# EAGLE design port_expander_1_0 (EAGLE 6.6.0)
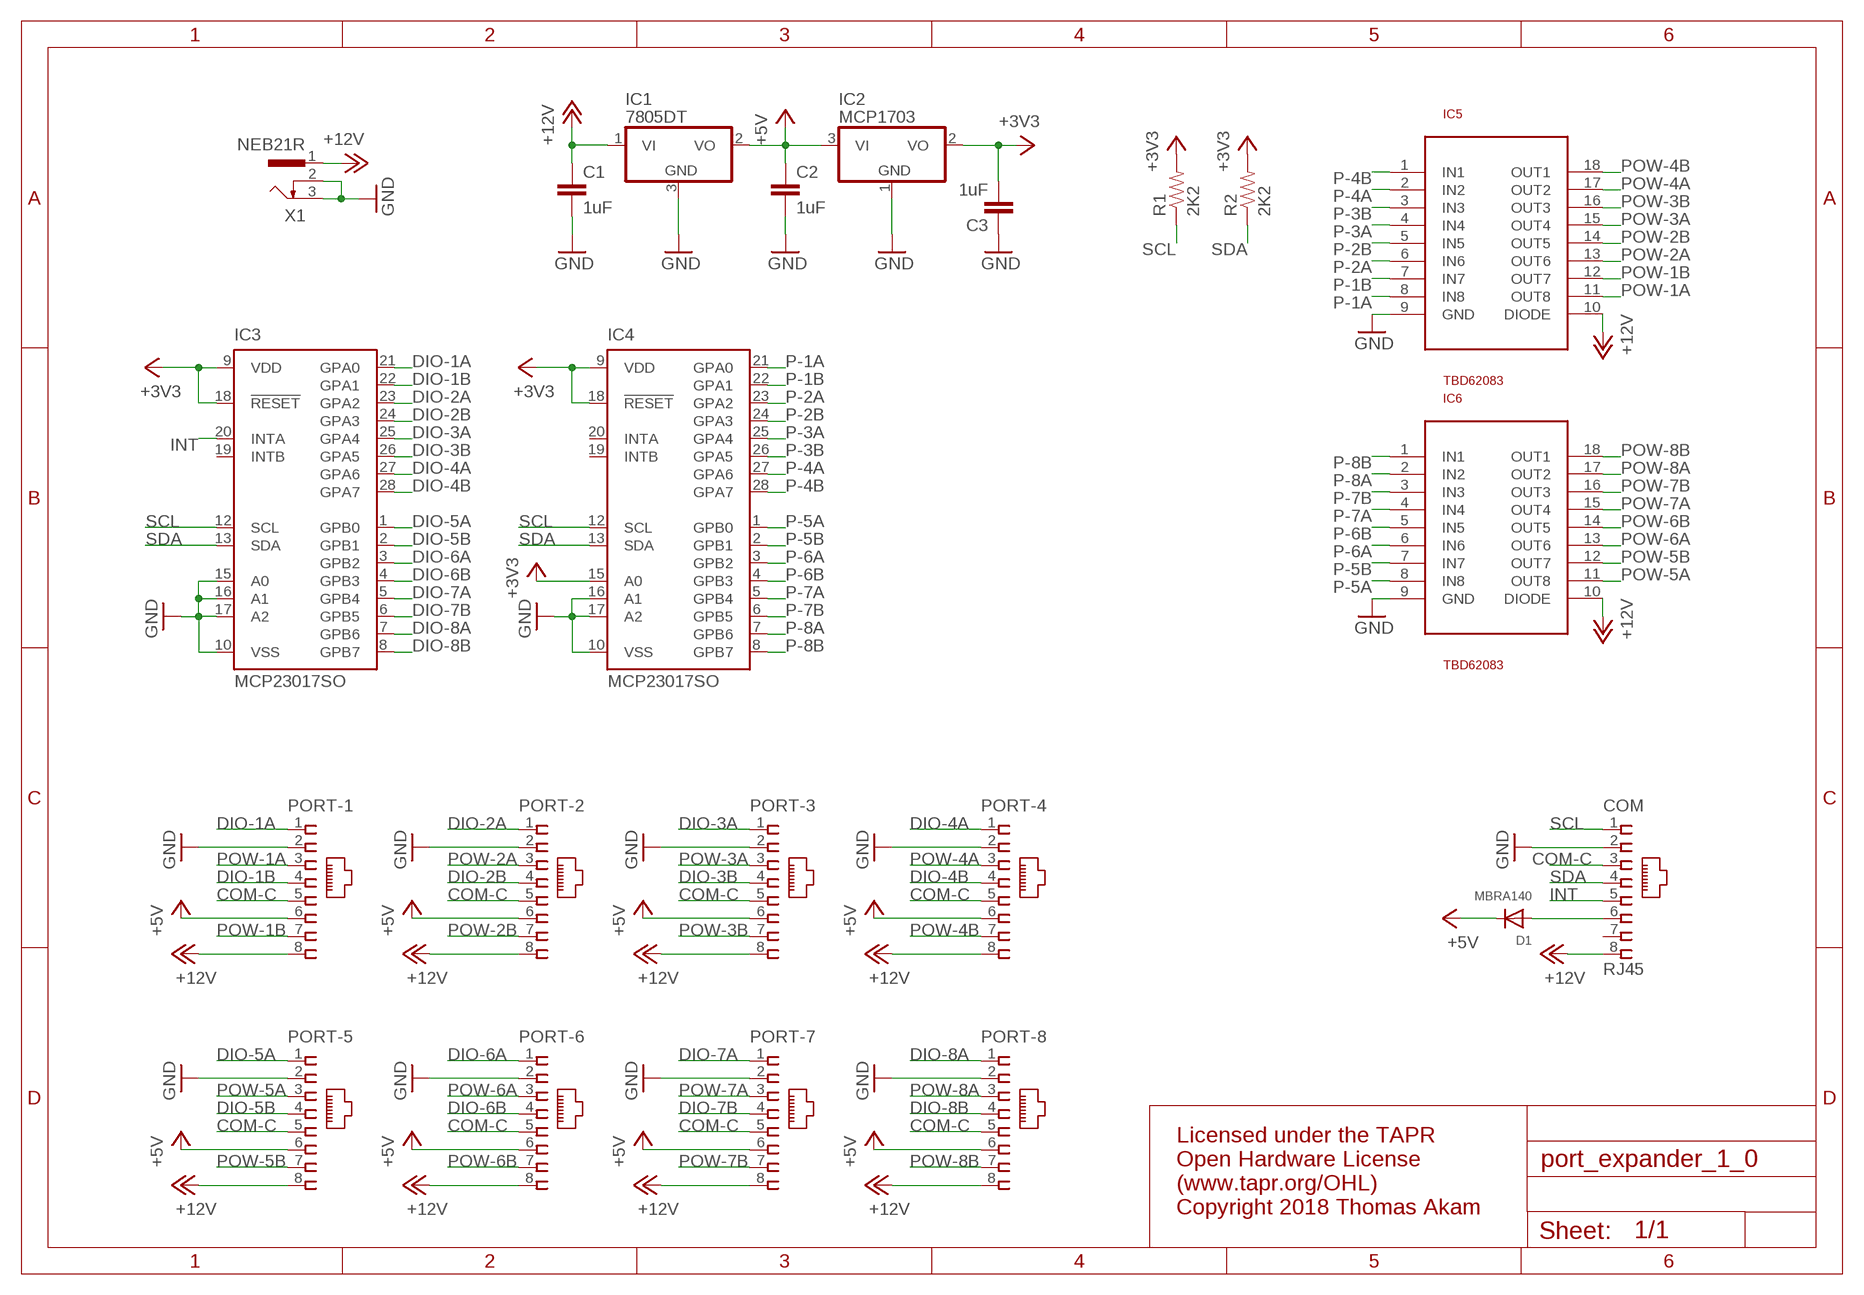
[diagram p0: schematic, sheet 1]

## Parts
C1  1uF  C-EUC0805  [C0805]
C2  1uF  C-EUC0805  [C0805]
C3  1uF  C-EUC0805  [C0805]
COM  RJ45  RJ45VERTICAL  [RJ45-NO-SHIELD-VERTICAL]
D1  MBRA140  DIODESOD-123  [SOD-123]
IC1  7805DT  [TO252]
IC2  MCP1703  MCP1703CB  [SOT23]
IC3  MCP23017SO  [SO28W]
IC4  MCP23017SO  [SO28W]
IC5  TBD62083  ULN2803  [SO18L]
IC6  TBD62083  ULN2803  [SO18L]
PORT-1  RJ45VERTICAL  [RJ45-NO-SHIELD-VERTICAL]
PORT-2  RJ45VERTICAL  [RJ45-NO-SHIELD-VERTICAL]
PORT-3  RJ45VERTICAL  [RJ45-NO-SHIELD-VERTICAL]
PORT-4  RJ45VERTICAL  [RJ45-NO-SHIELD-VERTICAL]
PORT-5  RJ45VERTICAL  [RJ45-NO-SHIELD-VERTICAL]
PORT-6  RJ45VERTICAL  [RJ45-NO-SHIELD-VERTICAL]
PORT-7  RJ45VERTICAL  [RJ45-NO-SHIELD-VERTICAL]
PORT-8  RJ45VERTICAL  [RJ45-NO-SHIELD-VERTICAL]
R1  2K2  0.3OHM-1/8W-1%(0805)  [0805]
R2  2K2  0.3OHM-1/8W-1%(0805)  [0805]
X1  NEB21R  [NEB21R]

## Nets
+3V3: C3.2 IC2.2(VO) IC3.9(VDD) IC3.18(!RESET) IC4.9(VDD) IC4.15(A0) IC4.18(!RESET) R1.2 R2.2
+5V: C2.1 D1.C IC1.2(VO) IC2.3(VI) PORT-1.6 PORT-2.6 PORT-3.6 PORT-4.6 PORT-5.6 PORT-6.6 PORT-7.6 PORT-8.6
+12V: C1.1 COM.8 IC1.1(VI) IC5.10(DIODE) IC6.10(DIODE) PORT-1.8 PORT-2.8 PORT-3.8 PORT-4.8 PORT-5.8 PORT-6.8 PORT-7.8 PORT-8.8 X1.1
COM-C: COM.3 PORT-1.5 PORT-2.5 PORT-3.5 PORT-4.5 PORT-5.5 PORT-6.5 PORT-7.5 PORT-8.5
DIO-1A: IC3.21(GPA0) PORT-1.1
DIO-1B: IC3.22(GPA1) PORT-1.4
DIO-2A: IC3.23(GPA2) PORT-2.1
DIO-2B: IC3.24(GPA3) PORT-2.4
DIO-3A: IC3.25(GPA4) PORT-3.1
DIO-3B: IC3.26(GPA5) PORT-3.4
DIO-4A: IC3.27(GPA6) PORT-4.1
DIO-4B: IC3.28(GPA7) PORT-4.4
DIO-5A: IC3.1(GPB0) PORT-5.1
DIO-5B: IC3.2(GPB1) PORT-5.4
DIO-6A: IC3.3(GPB2) PORT-6.1
DIO-6B: IC3.4(GPB3) PORT-6.4
DIO-7A: IC3.5(GPB4) PORT-7.1
DIO-7B: IC3.6(GPB5) PORT-7.4
DIO-8A: IC3.7(GPB6) PORT-8.1
DIO-8B: IC3.8(GPB7) PORT-8.4
GND: C1.2 C2.2 C3.1 COM.2 IC1.3(GND) IC2.1(GND) IC3.10(VSS) IC3.15(A0) IC3.16(A1) IC3.17(A2) IC4.10(VSS) IC4.16(A1) IC4.17(A2) IC5.9(GND) IC6.9(GND) PORT-1.2 PORT-2.2 PORT-3.2 PORT-4.2 PORT-5.2 PORT-6.2 PORT-7.2 PORT-8.2 X1.2 X1.3
INT: COM.5 IC3.20(INTA)
N$5: COM.6 D1.A
P-1A: IC4.21(GPA0) IC5.8(IN8)
P-1B: IC4.22(GPA1) IC5.7(IN7)
P-2A: IC4.23(GPA2) IC5.6(IN6)
P-2B: IC4.24(GPA3) IC5.5(IN5)
P-3A: IC4.25(GPA4) IC5.4(IN4)
P-3B: IC4.26(GPA5) IC5.3(IN3)
P-4A: IC4.27(GPA6) IC5.2(IN2)
P-4B: IC4.28(GPA7) IC5.1(IN1)
P-5A: IC4.1(GPB0) IC6.8(IN8)
P-5B: IC4.2(GPB1) IC6.7(IN7)
P-6A: IC4.3(GPB2) IC6.6(IN6)
P-6B: IC4.4(GPB3) IC6.5(IN5)
P-7A: IC4.5(GPB4) IC6.4(IN4)
P-7B: IC4.6(GPB5) IC6.3(IN3)
P-8A: IC4.7(GPB6) IC6.2(IN2)
P-8B: IC4.8(GPB7) IC6.1(IN1)
POW-1A: IC5.11(OUT8) PORT-1.3
POW-1B: IC5.12(OUT7) PORT-1.7
POW-2A: IC5.13(OUT6) PORT-2.3
POW-2B: IC5.14(OUT5) PORT-2.7
POW-3A: IC5.15(OUT4) PORT-3.3
POW-3B: IC5.16(OUT3) PORT-3.7
POW-4A: IC5.17(OUT2) PORT-4.3
POW-4B: IC5.18(OUT1) PORT-4.7
POW-5A: IC6.11(OUT8) PORT-5.3
POW-5B: IC6.12(OUT7) PORT-5.7
POW-6A: IC6.13(OUT6) PORT-6.3
POW-6B: IC6.14(OUT5) PORT-6.7
POW-7A: IC6.15(OUT4) PORT-7.3
POW-7B: IC6.16(OUT3) PORT-7.7
POW-8A: IC6.17(OUT2) PORT-8.3
POW-8B: IC6.18(OUT1) PORT-8.7
SCL: COM.1 IC3.12(SCL) IC4.12(SCL) R1.1
SDA: COM.4 IC3.13(SDA) IC4.13(SDA) R2.1
Unconnected: COM.7 IC3.19(INTB) IC4.19(INTB) IC4.20(INTA)

## Notes on the sheet
- Licensed under the TAPR
  Open Hardware License
  (www.tapr.org/OHL)
  Copyright 2018 Thomas Akam

## Library data of the parts
C1 C2 = resistor:C-EU: CAPACITOR, European symbol
C3 = rcl:C-EU: CAPACITOR, European symbol
COM PORT-1-PORT-8 = con-tycoelectronics-vertical_RJ45:RJ45: CORCOM Modular RJ Jacks No Shield Source: www.tycoelectronics.com .. ENG_DS_1654001_1099_RJ_L_0507.pdf
D1 = adafruit:DIODE: Diode SMADIODE - SMA Surface Mount Package 20V 1A Schottky Diode Digikey: 641-1014-6-ND DO-1N4148 - Through Hole Small Current Diode SOD-123 20V 1 A (.5mV Vf) Schottky Diode - Digikey: MBRX120TPMSCT-ND SOD-323 10V 570mA (.38mV Vf, 3ns) Schottky Diode - Digikey: ZLLS410CT-ND SOD-523 30V 30mA Schottky Diode (RB751S-40TE61) - Digikey: RB751S-40TE61CT-ND SOT23-R/W - SOT23 Package (R = Solder Paste/Reflow Ovens, W = Hand-Soldering) BAT54Film 40V 300mA - Digikey: 497-7162-1-ND
IC1 = linear:78*: Positive VOLTAGE REGULATOR Source: http://cache.national.com/ds/LM/LM78L05.pdf http://www.fairchildsemi.com/ds/LM/LM7805.pdf
IC2 = linear:MCP1703: 250 mA, 16V, Low Quiescent Current LDO Regulator Source: http://ww1.microchip.com/downloads/en/DeviceDoc/22049b.pdf
IC3 IC4 = microchip:MCP23017: http://ww1.microchip.com/downloads/en/DeviceDoc/21952a.pdf Source: http://ww1.microchip.com/downloads/en/DeviceDoc/21952a.pdf; MF: MICROCHIP; MPN: MCP23017-E/SO; OC_FARNELL: 1332087; OC_NEWARK: 31K2958
IC5 IC6 = uln2803:ULN2803
R1 R2 = SparkFun-Resistors:0.3OHM-1/8W-1%(0805): RES-11622; PROD_ID: RES-11622; VALUE: 0.3
X1 = con-lumberg:NEB21R: Netzgeräte-Einbaukupplung abgewinkelte Ausführung mit Öffner Source: http://www.lumberg.com/Produkte/PDFs/NEB21R.pdf; MPN: NEB 21 R; OC_FARNELL: 1217037; OC_NEWARK: 97K6458

## Board
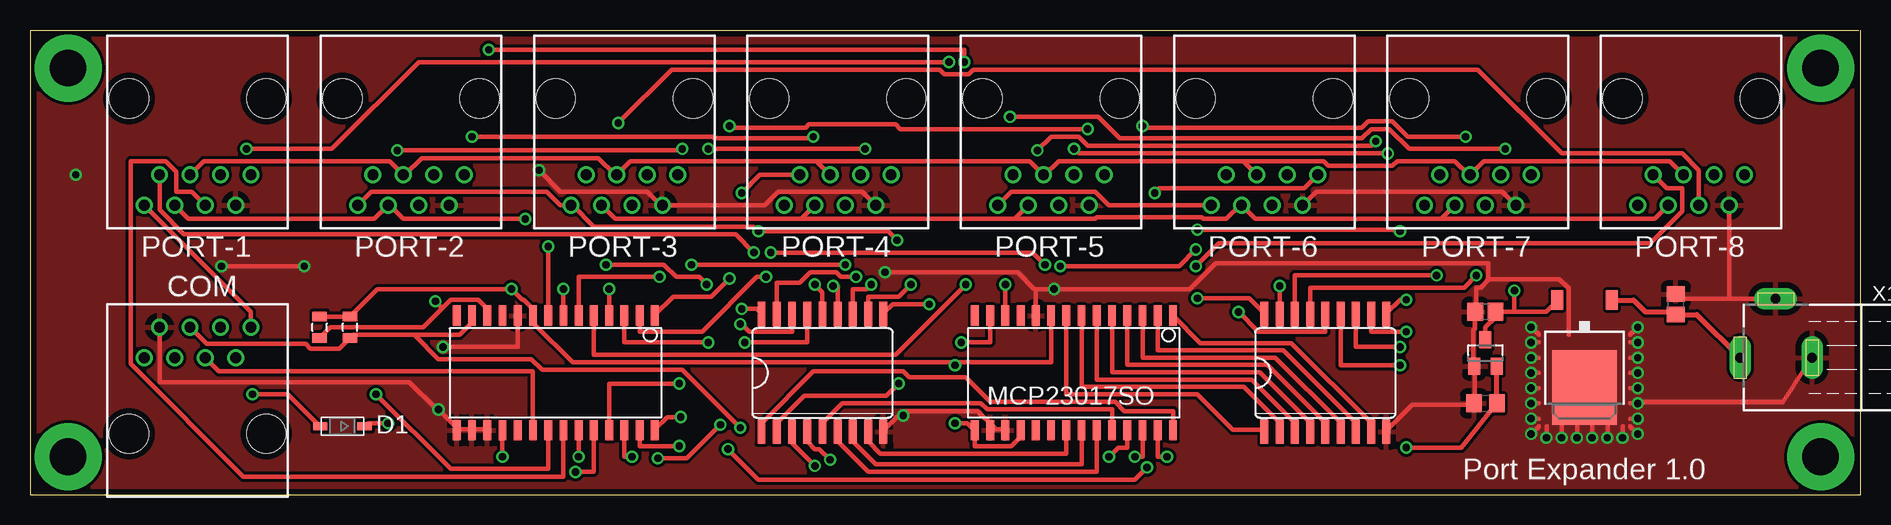
[diagram p1: board, top side]
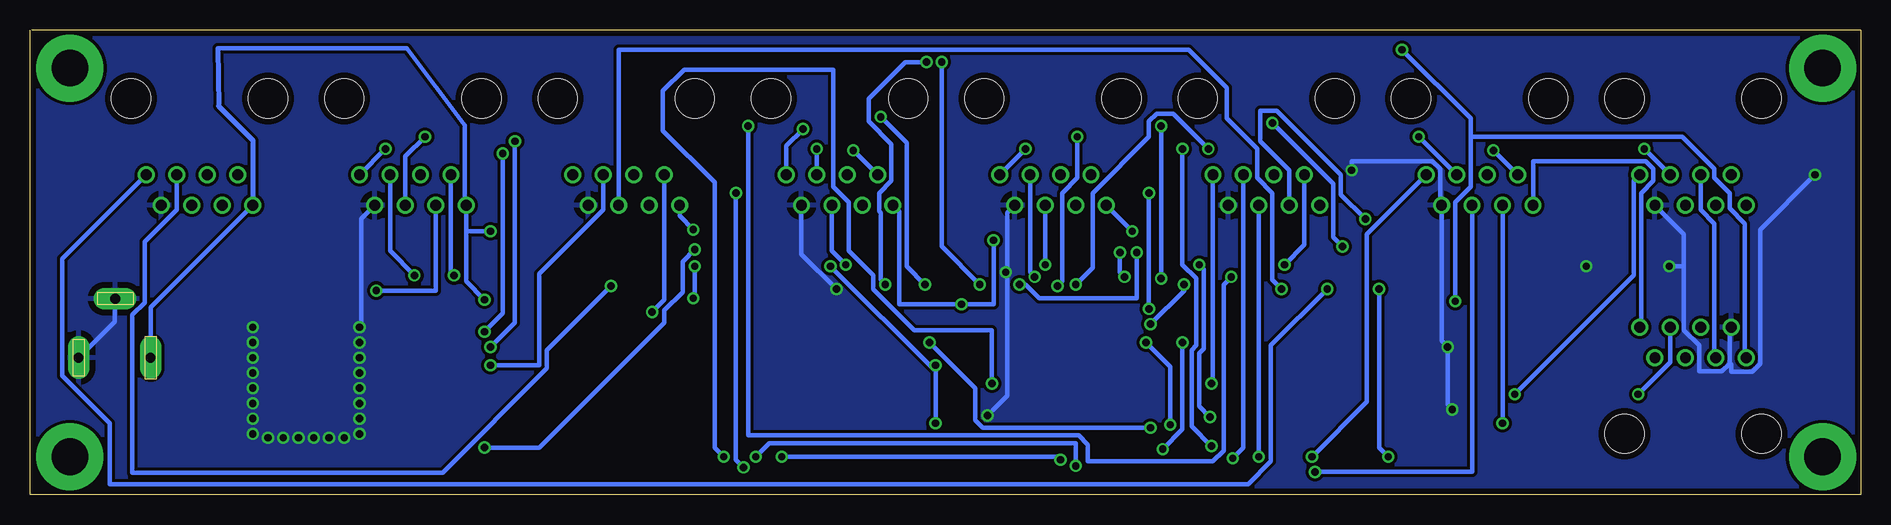
[diagram p2: board, bottom side, seen from below]

Size 152.56 x 38.73 mm. Coordinates in mm from the lower left corner, seen from the top.
Outline: 152.56,38.7 152.56,0 0,0 0,38.7
Outline: 0,38.73 152.4,38.73
Copper layers (1*16): Top 0.035mm / dielectric 1.5mm / Bottom 0.035mm
Design rules "default *": minimum track width 14mil, minimum drill 24mil, track to track 10mil, track to pad 10mil, pad to pad 10mil, via to via 10mil, smd to smd 10mil, copper to edge 20mil, drill to drill 8mil, minimum pad ring 10mil, minimum via ring 8mil, stop-mask expansion 4mil, vias tented up to drill 0mil, thermal gap 20mil
vRestrict: area 34.9,6.3 to 52.8,14; area 60.1,6.5 to 71.9,14.1; area 22.9,8.3 to 27.9,15.9; area 8.9,19.7 to 18.4,21.6; area 44.5,19.7 to 54,21.6; area 10.8,16.5 to 17.1,18.4; area 78.1,6.3 to 95.9,14; area 102.2,6.3 to 113.7,14; area 97.8,19.7 to 107.3,22.2; area 115.6,19.7 to 125.1,22.2; area 133.4,19.7 to 142.9,22.2; area 62.2,19.7 to 71.8,22.2; 5 more areas

### Footprints (pad centres in the part's own frame; a part is rotated, then mirrored left to right if it is on the bottom)
C0805 = smd 1.3 x 1.5: 1 -0.85,0; 2 0.85,0
C0805' = smd 1.3 x 1.5: 1 -0.95,0; 2 0.95,0
RJ45-NO-SHIELD-VERTICAL = drill 0.9 pad 1.4: 1 -4.445,5.08; 2 -3.175,7.62; 3 -1.905,5.08; 4 -0.635,7.62; 5 0.635,5.08; 6 1.905,7.62; 7 3.175,5.08; 8 4.445,7.62 | hole 3.251: -5.715,-1.27; 5.715,-1.27
SOD-123 = smd 1.2 x 0.7: A 1.85,0; C -1.85,0
TO252 = smd 1 x 1.6: 1 -2.28,-4.8; 2 2.28,-4.8 | smd 5.4 x 6.2: 3 0,2.5
SOT23 = smd 1 x 1.4: 1 -0.95,-1.1; 2 0.95,-1.1; 3 0,1.1
SO28W = smd 0.65 x 1.7: 1 -7.62,-4.78; 2 -6.35,-4.78; 3 -5.08,-4.78; 4 -3.81,-4.78; 5 -2.54,-4.78; 6 -1.27,-4.78; 7 0,-4.78; 8 1.27,-4.78; 9 2.54,-4.78; 10 3.81,-4.78; 11 5.08,-4.78; 12 6.35,-4.78; 13 7.62,-4.78; 14 8.89,-4.78; 15 8.89,4.78; 16 7.62,4.78; 17 6.35,4.78; 18 5.08,4.78; 19 3.81,4.78; 20 2.54,4.78; 21 1.27,4.78; 22 0,4.78; 23 -1.27,4.78; 24 -2.54,4.78; 25 -3.81,4.78; 26 -5.08,4.78; 27 -6.35,4.78; 28 -7.62,4.78
SO18L = smd 0.66 x 2.032: 1 -5.08,-4.902; 2 -3.81,-4.902; 3 -2.54,-4.902; 4 -1.27,-4.902; 5 0,-4.902; 6 1.27,-4.902; 7 2.54,-4.902; 8 3.81,-4.902; 9 5.08,-4.902; 10 5.08,4.902; 11 3.81,4.902; 12 2.54,4.902; 13 1.27,4.902; 14 0,4.902; 15 -1.27,4.902; 16 -2.54,4.902; 17 -3.81,4.902; 18 -5.08,4.902
0805 = smd 0.8 x 1.2: 1 -0.9,0; 2 0.9,0
NEB21R = drill 0.813 pad 1.778 long: 1 0,7.35; 2 4.9,4.4; 3 0,1.35

### Placement (x,y rotation side)
C1  137.16,15.88 90 top
C2  121.28,15.24 180 top
C3  1uF  [C0805']  121.28,7.62 0 top
COM  13.97,6.35 0 top
D1  26.04,5.71 180 top
IC1  129.54,11.43 180 top
IC2  121.28,11.81 0 top
IC3  44.45,10.16 180 top
IC4  87.63,10.16 180 top
IC5  66.04,10.16 0 top
IC6  107.95,10.16 0 top
PORT-1  13.97,31.75 180 top
PORT-2  31.75,31.75 180 top
PORT-3  49.53,31.75 180 top
PORT-4  67.31,31.75 180 top
PORT-5  85.09,31.75 180 top
PORT-6  102.87,31.75 180 top
PORT-7  120.65,31.75 180 top
PORT-8  138.43,31.75 180 top
R1  24.13,13.97 90 top
R2  26.67,13.97 90 top
X1  149.86,11.43 90 top

### Tracks (layer width: path | path; a pad name or v marks a point on that pad's centre or on a via)
+3V3  (via drill 0.61)
  Top 0.356: 122.3,10.79 IC2.2 | IC4.18 82.55,4.83 81.79,4.06 78.74,4.06 IC4.15 78.61,5.46 78.11,5.97 v77.09,5.97 | R1.2 R2.2 26.8,14.99 28.96,17.14 v40.13,17.14 41.02,16.26 41.15,16.26 41.91,15.49 IC3.9 42.04,14.86 42.04,14.22 45.21,11.05 77.09,11.05 | v39.37,3.17 IC3.18 | IC4.9 85.09,11.05 77.09,11.05 | v77.09,10.79 77.09,11.05 | v114.68,3.94 119.25,3.94 | v97.16,20.45 95.76,19.05 v85.85,19.05
  Top 0.406: IC2.2 C3.2 119.25,3.94
  Bottom 0.356: v39.37,3.17 40.13,3.94 v40.13,17.14 | v77.09,5.97 v77.09,10.79 77.22,10.41 v85.85,19.05 | v114.68,3.94 110.11,3.94 99.69,14.35 99.69,15.37 98.17,16.89 98.17,19.43 v97.16,20.45
+5V  (via drill 0.61)
  Top 0.356: IC2.3 121.28,13.97 122.05,14.73 122.05,15.24 C2.1 123.7,15.24 | 123.7,15.24 126.36,15.24 127.25,16.13 IC1.2 | 117.6,22.99 102.11,22.99 PORT-6.6 100.84,24.13 99.69,22.99 97.79,22.99 97.66,23.11 88.9,23.11 88.77,22.99 82.17,22.99 82.11,23.05 | PORT-7.6 117.6,22.99 | PORT-8.6 135.38,22.99 117.6,22.99 | v123.7,17.02 123.7,15.24 | v29.84,5.97 28.19,5.97 27.94,5.71 D1.C | PORT-1.6 13.21,22.99 28.7,22.99 PORT-2.6 29.97,24.13 31.11,22.99 v41.27,22.99 | PORT-3.6 48.77,22.99 64.26,22.99 | PORT-4.6 64.26,22.99 | 82.11,23.05 82.04,22.99 64.26,22.99 | 82.11,23.05 PORT-5.6
  Bottom 0.356: v123.7,17.02 118.75,17.02 PORT-7.6 | PORT-2.6 v29.84,5.97 | v41.27,22.99 43.31,25.02 43.31,26.67 48.64,32 50.04,32 50.04,29.46 47.62,27.05 PORT-3.6
+12V  (via drill 0.61)
  Top 0.356: 131.62,16.31 IC1.1 | v114.68,16.26 114.17,16.26 113.03,15.11 IC6.10 | v74.93,15.88 71.88,15.88 71.12,15.11 IC5.10 | PORT-6.8 89.92,24.13 88.77,25.27 81.79,25.27 PORT-5.8 | PORT-1.8 18.41,15.24 COM.8 | PORT-2.8 28.45,25.27 43.05,25.27 44.2,24.13 PORT-3.8 45.21,24.13 46.99,22.35 60.33,22.35 v60.71,21.97 71.5,21.97 v72.26,21.21 | v114.17,21.97 114.05,22.1 v97.28,22.1
  Top 0.406: IC1.1 133.63,16.23 134.62,15.24 136.94,15.24 C1.1 138.91,15.03 X1.1
  Bottom 0.356: X1.1 142.49,11.43 142.49,15.65 142.37,15.75 PORT-8.8 | v114.68,16.26 116.2,17.78 116.2,21.97 | 116.2,21.97 PORT-7.8 116.2,24.26 116.33,24.38 116.33,30.8 121.16,37.21 136.91,37.21 | PORT-5.8 80.14,23.62 80.14,15.88 v74.93,15.88 72.26,15.88 v72.26,21.21 | v60.71,21.97 PORT-4.8 | COM.8 18.29,14.1 18.29,25.15 17.27,26.16 17.27,27.18 17.91,27.81 27.3,27.81 PORT-2.8 | v114.17,21.97 116.2,21.97 | v97.28,22.1 98.42,23.24 PORT-6.8
  Bottom 0.406: 136.91,37.21 136.84,32.38 133.99,29.53 PORT-8.8
COM-C
  Top 0.356: PORT-1.5 14.48,27.81 29.97,27.81 PORT-2.5 31.24,26.67 32.64,28.07 47.37,28.07 48.77,26.67 PORT-3.5 50.04,27.81 65.53,27.81 | PORT-8.5 136.65,27.81 121.16,27.81 PORT-7.5 119.89,26.67 118.75,27.81 113.92,27.81 113.54,27.43 108.2,27.43 107.82,27.81 101.22,27.81 101.16,27.75 | PORT-4.5 65.53,27.81 | 65.53,27.81 83.31,27.81 PORT-5.5 84.58,26.67 85.72,27.81 101.09,27.81 101.16,27.75 | 101.16,27.75 PORT-6.5
  Bottom 0.356: COM.3 12.19,11.56 12.19,22.61 13.34,23.75 PORT-1.5
DIO-1A  (via drill 0.61)
  Top 0.356: IC3.21 43.18,2.16 35.05,2.16 v28.83,8.38
  Bottom 0.356: v28.83,8.38 18.92,18.29 18.92,26.16 PORT-1.1
DIO-1B
  Top 0.356: IC3.22 44.45,1.52 17.78,1.52 8.38,10.92 8.38,27.81 11.3,27.81 12.19,26.92 12.19,25.27 13.46,25.27 PORT-1.4
DIO-2A  (via drill 0.61)
  Top 0.356: v45.72,3.17 IC3.23
  Bottom 0.356: v45.72,3.17 41.15,7.75 41.15,21.72 PORT-2.1
DIO-2B  (via drill 0.61)
  Top 0.356: IC3.24 46.99,1.91 v45.47,1.91
  Bottom 0.356: v45.47,1.91 32.38,1.91 PORT-2.4
DIO-3A  (via drill 0.61)
  Top 0.356: IC3.25 48.26,9.27 v54.1,9.27
  Bottom 0.356: v54.1,9.27 53.98,9.4 PORT-3.1
DIO-3B  (via drill 0.61)
  Top 0.356: IC3.26 49.53,3.17 v50.16,3.17
  Bottom 0.356: PORT-3.4 v50.16,3.17
DIO-4A  (via drill 0.61)
  Top 0.356: IC3.27 50.8,4.06 v54.1,4.06 | v69.6,28.83 v56.52,28.83
  Bottom 0.356: v54.1,4.06 55.75,5.71 55.75,12.06 55.37,12.45 55.37,18.03 56.52,19.18 v56.52,28.83 | PORT-4.1 v69.6,28.83
DIO-4B  (via drill 0.61)
  Top 0.356: v54.23,6.48 53.09,6.48 52.07,5.46 IC3.28 | v67.94,19.18 v55.12,19.18
  Bottom 0.356: v54.23,6.48 55.12,7.37 55.12,11.81 54.74,12.19 54.74,18.8 v55.12,19.18 | PORT-4.4 v67.94,19.18
DIO-5A  (via drill 0.61)
  Top 0.356: v58.29,18.03 56.77,16.51 53.59,16.51 52.07,14.99 IC3.1 | v58.29,30.73 58.42,30.61 64.64,30.61 64.9,30.86 72.14,30.86 72.52,30.48 v88.14,30.48
  Bottom 0.356: v58.29,30.73 v58.29,18.03 | v88.14,30.48 89.53,29.08 PORT-5.1
DIO-5B  (via drill 0.61)
  Top 0.356: IC3.2 50.8,13.59 56.01,13.59 60.58,18.16 v61.34,18.16 | v61.72,20.19 83.57,20.19 v84.58,19.18
  Bottom 0.356: v61.34,18.16 61.72,18.54 v61.72,20.19 | v84.58,19.18 85.72,20.32 PORT-5.4
DIO-6A  (via drill 0.61)
  Top 0.356: IC3.3 49.53,12.7 v56.52,12.7 | v58.17,3.81 60.71,1.27 92.08,1.27 v93.09,2.29 | v93.73,25.15 94.11,25.53 106.17,25.53 PORT-6.1
  Bottom 0.356: v56.52,12.7 56.52,5.46 v58.17,3.81 | v93.09,2.29 93.73,2.92 v93.73,25.15
DIO-6B  (via drill 0.61)
  Top 0.356: v48.26,17.14 IC3.4
  Bottom 0.356: v48.26,17.14 49.02,17.91 49.02,25.15 50.29,26.42 50.29,28.83 52.83,31.37 52.83,33.91 56.01,37.08 103.5,37.08 PORT-6.4
DIO-7A  (via drill 0.61)
  Top 0.356: IC3.5 46.99,11.68 72.14,11.68 v77.98,17.53 | v81.66,31.5 89.03,31.5 90.81,29.72 111,29.72 111.76,30.48 113.28,30.48 114.94,28.83 v122.94,28.83
  Bottom 0.356: v77.98,17.53 79.5,19.05 79.5,29.34 v81.66,31.5 | PORT-7.1 v122.94,28.83
DIO-7B  (via drill 0.61)
  Top 0.356: IC3.6 45.72,18.16 v52.45,18.16 | v92.71,30.73 92.84,30.61 111,30.61 111.51,31.11 113.54,31.11 114.81,29.84 v119.63,29.84
  Bottom 0.356: v52.45,18.16 53.09,17.53 53.09,3.68 53.98,2.79 64.39,2.79 64.39,4.19 65.15,4.95 92.71,4.95 v92.71,30.73 | v119.63,29.84 121.28,28.19 PORT-7.4
DIO-8A  (via drill 0.61)
  Top 0.356: v44.45,17.14 IC3.7
  Bottom 0.356: v44.45,17.14 49.15,12.45 49.15,2.79 51.05,0.89 145.92,0.89 145.92,5.97 149.86,9.91 149.86,19.68 PORT-8.1
DIO-8B  (via drill 0.61)
  Top 0.356: v43.18,20.7 IC3.8 | v49.02,30.99 53.47,35.43 75.82,35.43 76.2,35.05 78.23,35.05 78.61,35.43 120.65,35.43 127.64,28.45 137.67,28.45 139.06,27.05 PORT-8.4
  Bottom 0.356: v43.18,20.7 43.94,21.46 43.94,25.91 v49.02,30.99
GND  (via drill 0.61)
  Top 0.356: 141.6,16.36 145.44,16.36 X1.2 | 141.6,16.36 137.52,16.36 137.16,16.71 C1.2 | v125.09,5.08 125.12,4.76 125.58,5.54 125.63,5.54 125.73,5.71 | v133.99,10.16 133.35,10.16 | 125.73,6.35 v125.09,6.35 124.97,6.45 | 125.73,7.62 v125.09,7.62 | 125.73,8.89 v125.09,8.89 | 125.73,10.16 v125.09,10.16 | 125.73,11.43 v125.09,11.43 | 125.73,12.7 v125.09,12.7 | v125.09,13.97 125.12,13.97 125.58,13.51 125.63,13.51 125.73,13.34 | 126.39,5.71 126.39,4.76 v126.36,4.76 | 127.66,5.71 127.66,4.76 v127.64,4.76 | 128.93,5.71 128.93,4.76 v128.91,4.76 | 130.2,5.71 130.2,4.76 v130.18,4.76 | 131.47,5.71 131.47,4.76 v131.44,4.76 | 132.74,5.71 132.74,4.76 v132.72,4.76 | v133.99,5.08 133.96,4.76 133.5,5.54 133.45,5.54 133.35,5.71 | 133.35,6.35 v133.99,6.35 | 133.35,7.62 v133.99,7.62 | 133.35,8.89 v133.99,8.89 | 133.35,11.43 v133.99,11.43 | 133.35,12.7 v133.99,12.7 | v133.99,13.97 133.96,13.97 133.5,13.51 133.45,13.51 133.35,13.34 | 146.05,7.72 148.49,11.43 X1.3 | PORT-6.2 107.19,25.27 122.68,25.27 PORT-7.2 | 141.6,16.36 PORT-8.2 | IC6.9 113.03,5.33 115.19,7.49 120.27,7.49 C3.1 120.4,7.62 120.4,8.89 120.4,10.67 IC2.1 120.27,10.79 120.27,13.72 120.4,13.84 120.4,15.24 C2.2 120.52,15.37 120.52,17.27 120.9,17.27 121.54,17.91 121.54,17.98 | IC3.17 38.1,5.46 36.96,5.46 IC3.16 36.83,5.46 35.56,5.46 IC3.15 35.56,5.59 v34.04,7.11 33.91,7.11 31.62,9.4 10.79,9.4 COM.2 | IC3.10 40.64,12.32 v34.42,12.32 | 83.82,17.14 IC4.10 | 83.82,17.14 v85.34,17.14 96.65,17.14 98.81,19.3 121.54,19.3 121.54,17.98 | 80.39,5.46 81.28,5.46 IC4.17 | 80.39,5.46 80.01,5.46 IC4.16 | 72.58,6.79 72.77,6.99 78.99,6.99 80.39,5.59 80.39,5.46 | 72.58,6.79 71.12,5.33 IC5.9
  Top 0.356: PORT-4.2 69.34,25.27 62.36,25.27 61.21,24.13 PORT-3.2 52.58,24.13 51.44,25.27 44.2,25.27 v42.42,27.05 | v72.77,6.6 72.58,6.79 | v71.25,18.54 82.3,18.54 83.69,17.14 83.82,17.14 | v15.95,19.05 v22.86,19.05 | 121.54,17.98 121.67,17.98 127.46,17.98 128.22,17.22 128.22,13.51 128.22,13.34
  Top 0.406: 146.05,7.72 133.99,7.72 v133.99,7.62
  Bottom 0.356: X1.3 148.49,11.43 145.49,14.43 145.49,16.31 X1.2 | 125.07,13.97 v125.09,13.97 124.97,14.1 124.97,22.99 PORT-7.2 | COM.2 10.92,13.84 10.92,10.92 | 10.92,10.92 11.56,10.29 13.46,10.29 13.46,12.45 14.73,13.72 14.73,19.05 | 14.73,19.05 14.73,21.72 PORT-1.2 | v34.04,7.11 34.42,7.49 v34.42,12.32 34.92,12.83 PORT-2.2 34.92,24.26 35.05,24.38 35.05,27.18 35.69,27.81 42.42,27.81 v42.42,27.05 | v85.34,17.14 88.27,20.07 PORT-5.2 | v72.77,6.6 71.12,8.26 71.12,18.54 | 71.12,18.54 71.12,23.5 PORT-4.2 | v71.25,18.54 71.12,18.54 | v3.81,26.67 8.38,22.1 8.38,10.92 9.04,10.26 10.77,10.26 10.77,10.87 10.92,10.92 | v15.95,19.05 14.88,19.05 14.73,19.05
  pour Bottom: 0,0 0,38.73 152.4,38.73 152.4,0
  pour Top: 0,0 152.4,0 152.4,38.73 0,38.73
  pour Top (no thermals): 125.73,13.34 133.35,13.34 133.35,5.08 125.73,5.08
INT
  Top 0.356: IC3.20 41.91,10.29 15.75,10.29 COM.5
N$1  (via drill 3.05 pad 5.59)
  other vias: 149.22,35.56
N$2  (via drill 3.05 pad 5.59)
  other vias: 3.17,3.17
N$3  (via drill 3.05 pad 5.59)
  other vias: 3.17,35.56
N$4  (via drill 3.05 pad 5.59)
  other vias: 149.22,3.17
N$5  (via drill 0.61)
  Top 0.356: v18.54,8.38 21.46,8.38 24.13,5.71 D1.A
  Bottom 0.356: v18.54,8.38 15.88,11.05 COM.6
P-1A
  Top 0.356: IC4.21 86.36,3.43 70.87,3.43 69.85,4.45 IC5.8
P-1B
  Top 0.356: IC4.22 87.63,2.54 70.48,2.54 68.58,4.45 IC5.7
P-2A
  Top 0.356: IC4.23 88.9,1.91 69.85,1.91 67.31,4.45 IC5.6
P-2B
  Top 0.356: IC4.24 90.17,7.11 79.76,7.11 79.25,7.62 67.69,7.62 66.04,5.97 IC5.5
P-3A  (via drill 0.61)
  Top 0.356: IC4.25 91.44,3.94 90.68,3.94 v89.92,3.17 | v66.67,2.92 65.79,3.81 65.41,3.81 64.77,4.45 IC5.4
  Bottom 0.356: v89.92,3.17 66.67,3.17 v66.67,2.92
P-3B  (via drill 0.61)
  Top 0.356: IC4.26 92.71,3.17 v92.08,3.17 | v65.41,2.41 63.5,4.32 IC5.3
  Bottom 0.356: v92.08,3.17 90.93,4.32 65.41,4.32 v65.41,2.41
P-4A  (via drill 0.61)
  Top 0.356: IC4.27 93.98,3.17 v94.74,3.17 | v72.39,9.27 71.37,8.26 64.52,8.26 62.23,5.97 IC5.2
  Bottom 0.356: v94.74,3.17 95.5,3.94 95.5,26.04 99.82,30.35 99.82,33.66 98.04,35.43 85.6,35.43 85.6,25.65 84.33,24.38 84.33,20.32 82.3,18.29 82.3,17.14 78.87,13.72 72.39,13.72 v72.39,9.27
P-4B
  Top 0.356: IC4.28 95.25,6.99 91.19,6.99 90.42,7.75 80.01,7.75 77.98,9.78 73.28,9.78 72.77,10.29 65.28,10.29 60.96,5.97 IC5.1
P-5A
  Top 0.356: IC6.8 111.76,5.99 105.11,12.65 97.54,12.65 IC4.1
P-5B
  Top 0.356: IC4.2 93.98,12.04 104.44,12.04 110.49,5.99 IC6.7
P-6A
  Top 0.356: IC4.3 92.71,11.43 103.78,11.43 109.22,5.99 IC6.6
P-6B
  Top 0.356: IC4.4 91.44,10.82 103.12,10.82 107.95,5.99 IC6.5
P-7A
  Top 0.356: IC4.5 90.17,10.21 102.46,10.21 106.68,5.99 IC6.4
P-7B
  Top 0.356: IC4.6 88.9,9.6 101.8,9.6 105.41,5.99 IC6.3
P-8A
  Top 0.356: IC4.7 87.63,8.99 101.14,8.99 104.14,5.99 IC6.2
P-8B
  Top 0.356: IC4.8 86.36,8.38 97.28,8.38 100.23,5.44 102.72,5.44 102.87,5.28 IC6.1
POW-1A  (via drill 0.61)
  Top 0.356: IC5.11 69.85,16.51 72.39,16.51 v73.41,17.53 | v76.58,36.07 32.38,36.07 25.15,28.83 v18.03,28.83
  Bottom 0.356: v73.41,17.53 76.58,20.7 v76.58,36.07 | PORT-1.3 v18.03,28.83
POW-1B  (via drill 0.61)
  Top 0.356: IC5.12 68.58,17.14 69.72,17.14 v70.1,17.53 | v60.33,20.19 58.8,21.72 12.83,21.72 10.79,23.75 PORT-1.7
  Bottom 0.356: v70.1,17.53 69.6,17.53 68.45,16.38 60.33,16.38 v60.33,20.19
POW-2A  (via drill 0.61)
  Top 0.356: IC5.13 67.31,17.4 v66.93,17.4 | v65.28,29.84 65.15,29.72 57.02,29.72 56.9,29.84 v36.83,29.84
  Bottom 0.356: v66.93,17.4 66.55,17.78 66.55,25.15 65.28,26.42 v65.28,29.84 | PORT-2.3 v36.83,29.84
POW-2B  (via drill 0.61)
  Top 0.356: IC5.14 66.04,16.89 v65.41,17.53 | v54.36,28.83 54.23,28.7 v30.61,28.7
  Bottom 0.356: v65.41,17.53 64.01,18.92 64.01,25.15 59.31,29.84 59.31,31.11 58.67,31.75 57.28,31.75 v54.36,28.83 | PORT-2.7 v30.61,28.7
POW-3A  (via drill 0.61)
  Top 0.356: IC5.15 64.77,12.7 v59.56,12.7 | v57.53,5.84 54.74,3.05 v52.32,3.05
  Bottom 0.356: v59.56,12.7 57.53,10.67 v57.53,5.84 | v52.32,3.05 51.44,3.94 PORT-3.3
POW-3B  (via drill 0.61)
  Top 0.356: IC5.16 63.5,13.59 59.94,13.59 59.31,14.22 v59.18,14.22 | v56.39,17.53 55.75,18.16 53.85,18.16 52.83,19.18 v48.01,19.18
  Bottom 0.356: v59.18,14.22 56.39,17.02 v56.39,17.53 | v48.01,19.18 46.35,20.83 PORT-3.7
POW-4A  (via drill 0.61)
  Top 0.356: IC5.17 62.23,17.65 64.14,17.65 65.02,18.54 67.18,18.54 67.56,18.16 v68.83,18.16
  Bottom 0.356: v68.83,18.16 69.22,18.54 PORT-4.3
POW-4B  (via drill 0.61)
  Top 0.356: v59.31,15.49 60.58,15.49 60.96,15.11 IC5.18 | v59.31,25.15 60.83,26.67 PORT-4.7
  Bottom 0.356: v59.31,25.15 v59.31,15.49
POW-5A  (via drill 0.61)
  Top 0.356: IC6.11 111.76,13.59 v114.68,13.59 | v113.16,28.45 87.38,28.45 v87,28.83
  Bottom 0.356: v114.68,13.59 113.16,15.11 v113.16,28.45 | PORT-5.3 v87,28.83
POW-5B  (via drill 0.61)
  Top 0.356: IC6.12 110.49,12.32 v114.17,12.32 | v112.14,29.46 111.76,29.08 88.14,29.08 87.38,29.84 85.09,29.84 v83.95,28.7
  Bottom 0.356: v114.17,12.32 112.14,14.35 v112.14,29.46 | PORT-5.7 v83.95,28.7
POW-6A  (via drill 0.61)
  Top 0.356: IC6.13 109.22,10.79 v114.17,10.79
  Bottom 0.356: v114.17,10.79 110.11,10.79 110.11,18.41 104.78,23.75 PORT-6.3
POW-6B  (via drill 0.61)
  Top 0.356: IC6.14 107.95,13.59 102.36,13.59 v100.71,15.24
  Bottom 0.356: v100.71,15.24 99.69,16.26 PORT-6.7
POW-7A  (via drill 0.61)
  Top 0.356: IC6.15 106.68,17.27 119.51,17.27 v120.52,18.29
  Bottom 0.356: v120.52,18.29 122.56,20.32 PORT-7.3
POW-7B  (via drill 0.61)
  Top 0.356: IC6.16 105.41,18.29 v117.22,18.29
  Bottom 0.356: v117.22,18.29 117.47,18.54 PORT-7.7
POW-8A  (via drill 0.61)
  Top 0.356: v104.14,17.4 IC6.17
  Bottom 0.356: v104.14,17.4 109.47,12.06 109.47,10.54 118.17,1.84 144.02,1.84 144.02,14.99 143,16 143,21.08 140.34,23.75 PORT-8.3
POW-8B  (via drill 0.61)
  Top 0.356: v97.28,16.38 101.6,16.38 102.87,15.11 IC6.18 | v97.16,19.05 99.06,20.95 135,20.95 137.67,23.62 137.67,25.53 136.4,25.53 PORT-8.7
  Bottom 0.356: v97.28,16.38 97.16,16.51 v97.16,19.05
SCL  (via drill 0.61)
  Top 0.356: 34.35,15.56 35.05,16.26 37.34,16.26 38.1,15.49 IC3.12 | 34.35,15.56 32.77,13.97 25.02,13.97 R1.1 | v81.28,17.53 IC4.12 | v77.85,36.07 77.85,37.08 v38.23,37.08 | 34.35,15.56 v33.78,16.13
  Bottom 0.356: v81.28,17.53 81.66,17.91 81.66,23.5 81.79,23.62 81.79,25.15 80.77,26.16 80.77,29.21 82.68,31.11 82.68,33.02 79.63,36.07 v77.85,36.07 | v38.23,37.08 32.51,31.37 32.51,29.84 | 32.51,29.84 32.51,25.65 33.78,24.38 v33.78,16.13 | COM.1 9.65,11.56 9.65,22.61 10.92,23.88 10.92,25.15 12.19,26.42 12.19,27.18 14.86,29.84 32.51,29.84
SDA  (via drill 0.61)
  Top 0.356: 32.13,13.34 35.81,13.34 36.83,14.35 IC3.13 | 32.13,13.34 26.92,13.34 R2.1 26.54,12.95 25.78,12.19 23.37,12.19 22.99,12.57 14.73,12.57 COM.4 | IC4.13 80.01,12.7 v77.6,12.7 | v59.18,5.59 54.36,10.41 42.67,10.41 41.78,11.3 34.04,11.3 32.13,13.21 32.13,13.34
  Bottom 0.356: v77.6,12.7 73.79,8.89 73.79,6.22 73.15,5.59 v59.18,5.59

### Text on the board
tNames: Port Expander 1.0
Document: Licensed under the TAPR Open Hardware License / (www.tapr.org/OHL) / Copyright 2018 Thomas Akam
tDocu: Licensed under the TAPR Open Hardware License / (www.tapr.org/OHL) / Copyright 2018 Thomas Akam